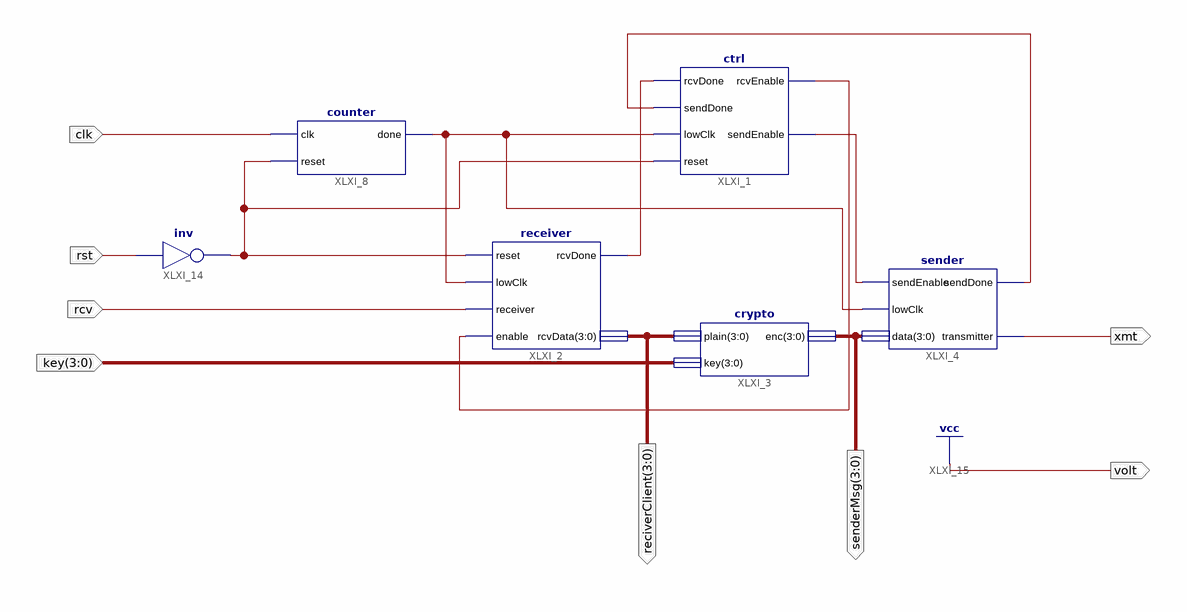
[diagram p0: schematic sheet 1]
// Xilinx ISE schematic top.sch (xc9500xl) as structural Verilog: 6 symbols, 8 ports
module top (
  input  [3:0] key,
  input  rcv,
  input  clk,
  input  rst,
  output [3:0] reciverClient,
  output xmt,
  output volt,
  output [3:0] senderMsg
);

  wire XLXN_2, XLXN_3, XLXN_8, XLXN_20, XLXN_42, XLXN_45;

  sender XLXI_4 (.sendEnable(XLXN_8), .lowClk(XLXN_20), .data(senderMsg), .sendDone(XLXN_2), .transmitter(xmt));
  crypto XLXI_3 (.plain(reciverClient), .key(key), .enc(senderMsg));
  receiver XLXI_2 (
    .reset(XLXN_42), .lowClk(XLXN_20), .receiver(rcv), .enable(XLXN_3), .rcvDone(XLXN_45),
    .rcvData(reciverClient));
  counter XLXI_8 (.clk(clk), .reset(XLXN_42), .done(XLXN_20));
  ctrl XLXI_1 (
    .rcvDone(XLXN_45), .sendDone(XLXN_2), .lowClk(XLXN_20), .rcvEnable(XLXN_3), .sendEnable(XLXN_8),
    .reset(XLXN_42));
  not XLXI_14 (XLXN_42, rst);

  assign volt = 1'b1;
endmodule
